# Altium schematic sheet USBC_Protection.SchDoc
size A4; SheetNumber: 1; SheetTotal: 4
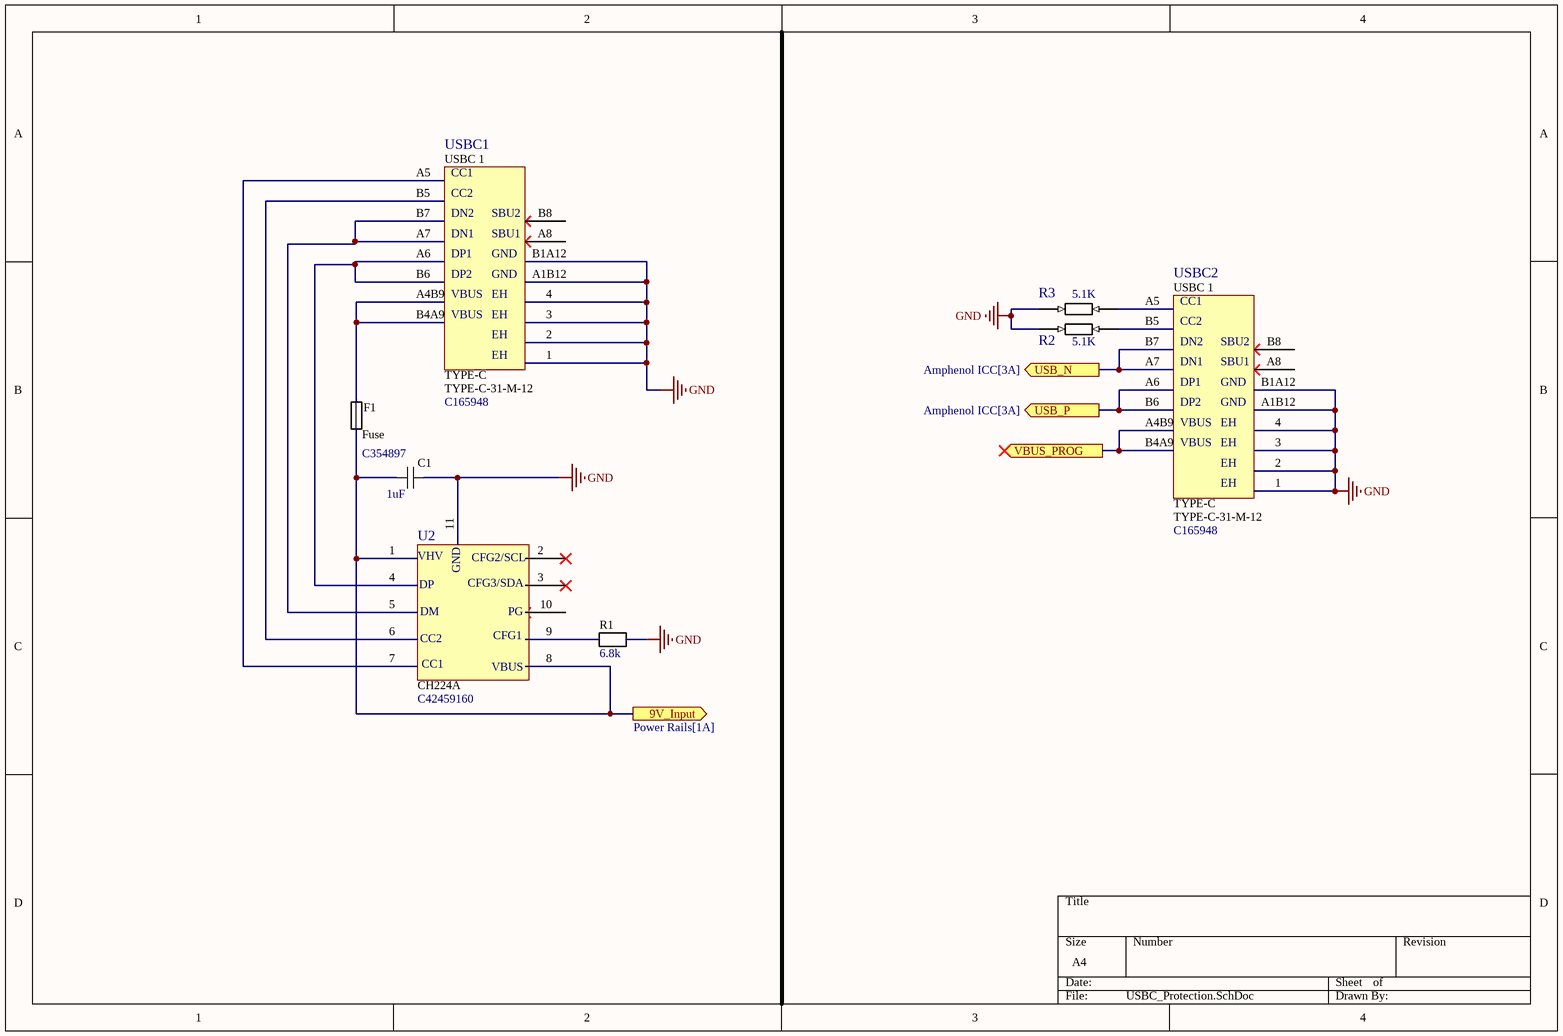
[diagram p0: USBC_Protection.SchDoc]

## Parts
C1  value 1uF  [C0603]  (hidden comment: CL10A105KB8NNNC)
F1  Fuse  Name: C354897  [F1206]
R1  value 6.8k  [R0603]  (hidden comment: CQ03WAJ0682T5E)
R2  value 5.1K  [R0603]  (hidden comment: 0603WAF5101T5E)
R3  value 5.1K  [R0603]  (hidden comment: 0603WAF5101T5E)
U2  CH224A  Name: C42459160  [ESSOP-10_L4.9-W3.9-P1.0-LS6.0-TL-EP]
USBC1  TYPE-C-31-M-12  Name: C165948  [USB-C_SMD-TYPE-C-31-M-12_1]
USBC2  TYPE-C-31-M-12  Name: C165948  [USB-C_SMD-TYPE-C-31-M-12_1]

## Ports
9V_Input (out, see Power Rails[1A]), USB_N (out, see Amphenol ICC[3A]), USB_P (out, see Amphenol ICC[3A]), VBUS_PROG (out)

## Nets
GND: C1.1 R1.2 R2.1 R3.1 U2.11 USBC1.1 USBC1.2 USBC1.3 USBC1.4 USBC1.A1B12 USBC1.B1A12 USBC2.1 USBC2.2 USBC2.3 USBC2.4 USBC2.A1B12 USBC2.B1A12
9V_Input: C1.2 F1.1 U2.1 U2.8 ; port 9V_Input
USB_N: USBC2.A7(B14) USBC2.B7(B13) ; port USB_N
USB_P: USBC2.A6(B15) USBC2.B6(B16) ; port USB_P
VBUS_PROG: USBC2.A4B9(B9) USBC2.B4A9(B10) ; port VBUS_PROG
NetF1_2: F1.2 USBC1.A4B9(B9) USBC1.B4A9(B10)
NetR1_1: R1.1 U2.9
NetR2_2: R2.2 USBC2.B5(B12)
NetR3_2: R3.2 USBC2.A5(B11)
NetU2_4: U2.4 USBC1.A6(B15) USBC1.B6(B16)
NetU2_5: U2.5 USBC1.A7(B14) USBC1.B7(B13)
NetU2_6: U2.6 USBC1.B5(B12)
NetU2_7: U2.7 USBC1.A5(B11)

Not connected (* = marked no-connect by the designer): U2 2* 3* 10*; USBC1 A8(7)* B8(8)*; USBC2 A8(7)* B8(8)*

## Notes on the sheet
- (in symbol CH224A) VHV; CFG2/SCL; GND; DP; CFG3/SDA; DM; PG; CC2; CFG1; CC1; VBUS
- (in symbol TYPE-C-31-M-12) USBC 1; CC1; CC2; DN2; SBU2; DN1; SBU1; DP1; GND; DP2; VBUS; EH; TYPE-C

## Library data of the parts
C1 = CL10A105KB8NNNC: 1uF ±10% 50V Ceramic Capacitor X5R 0603; Name: C15849; Source: LCSC
F1 = 1206T3A63V: 3A Fuse Surface Mount 1206; Source: LCSC
R1 = CQ03WAJ0682T5E: 6.8kÎ© Â±5% 100mW 0603 Thick Film Resistor AEC-Q200; Name: C2770993; Source: LCSC
R2 R3 = 0603WAF5101T5E: 5.1kÎ© Â±1% 100mW 0603 Thick Film Resistor; Name: C23186; Source: LCSC
U2 = CH224A: Power Receiver Controller 1C 140W ESSOP-10 Power Management - Specialized RoHS; Source: LCSC
USBC1 USBC2 = TYPE-C-31-M-12: USB-C (USB TYPE-C) Receptacle Connector 16 Position Surface Mount; Source: LCSC